# Altium project wifi小车_驱动控制板.PrjPcb
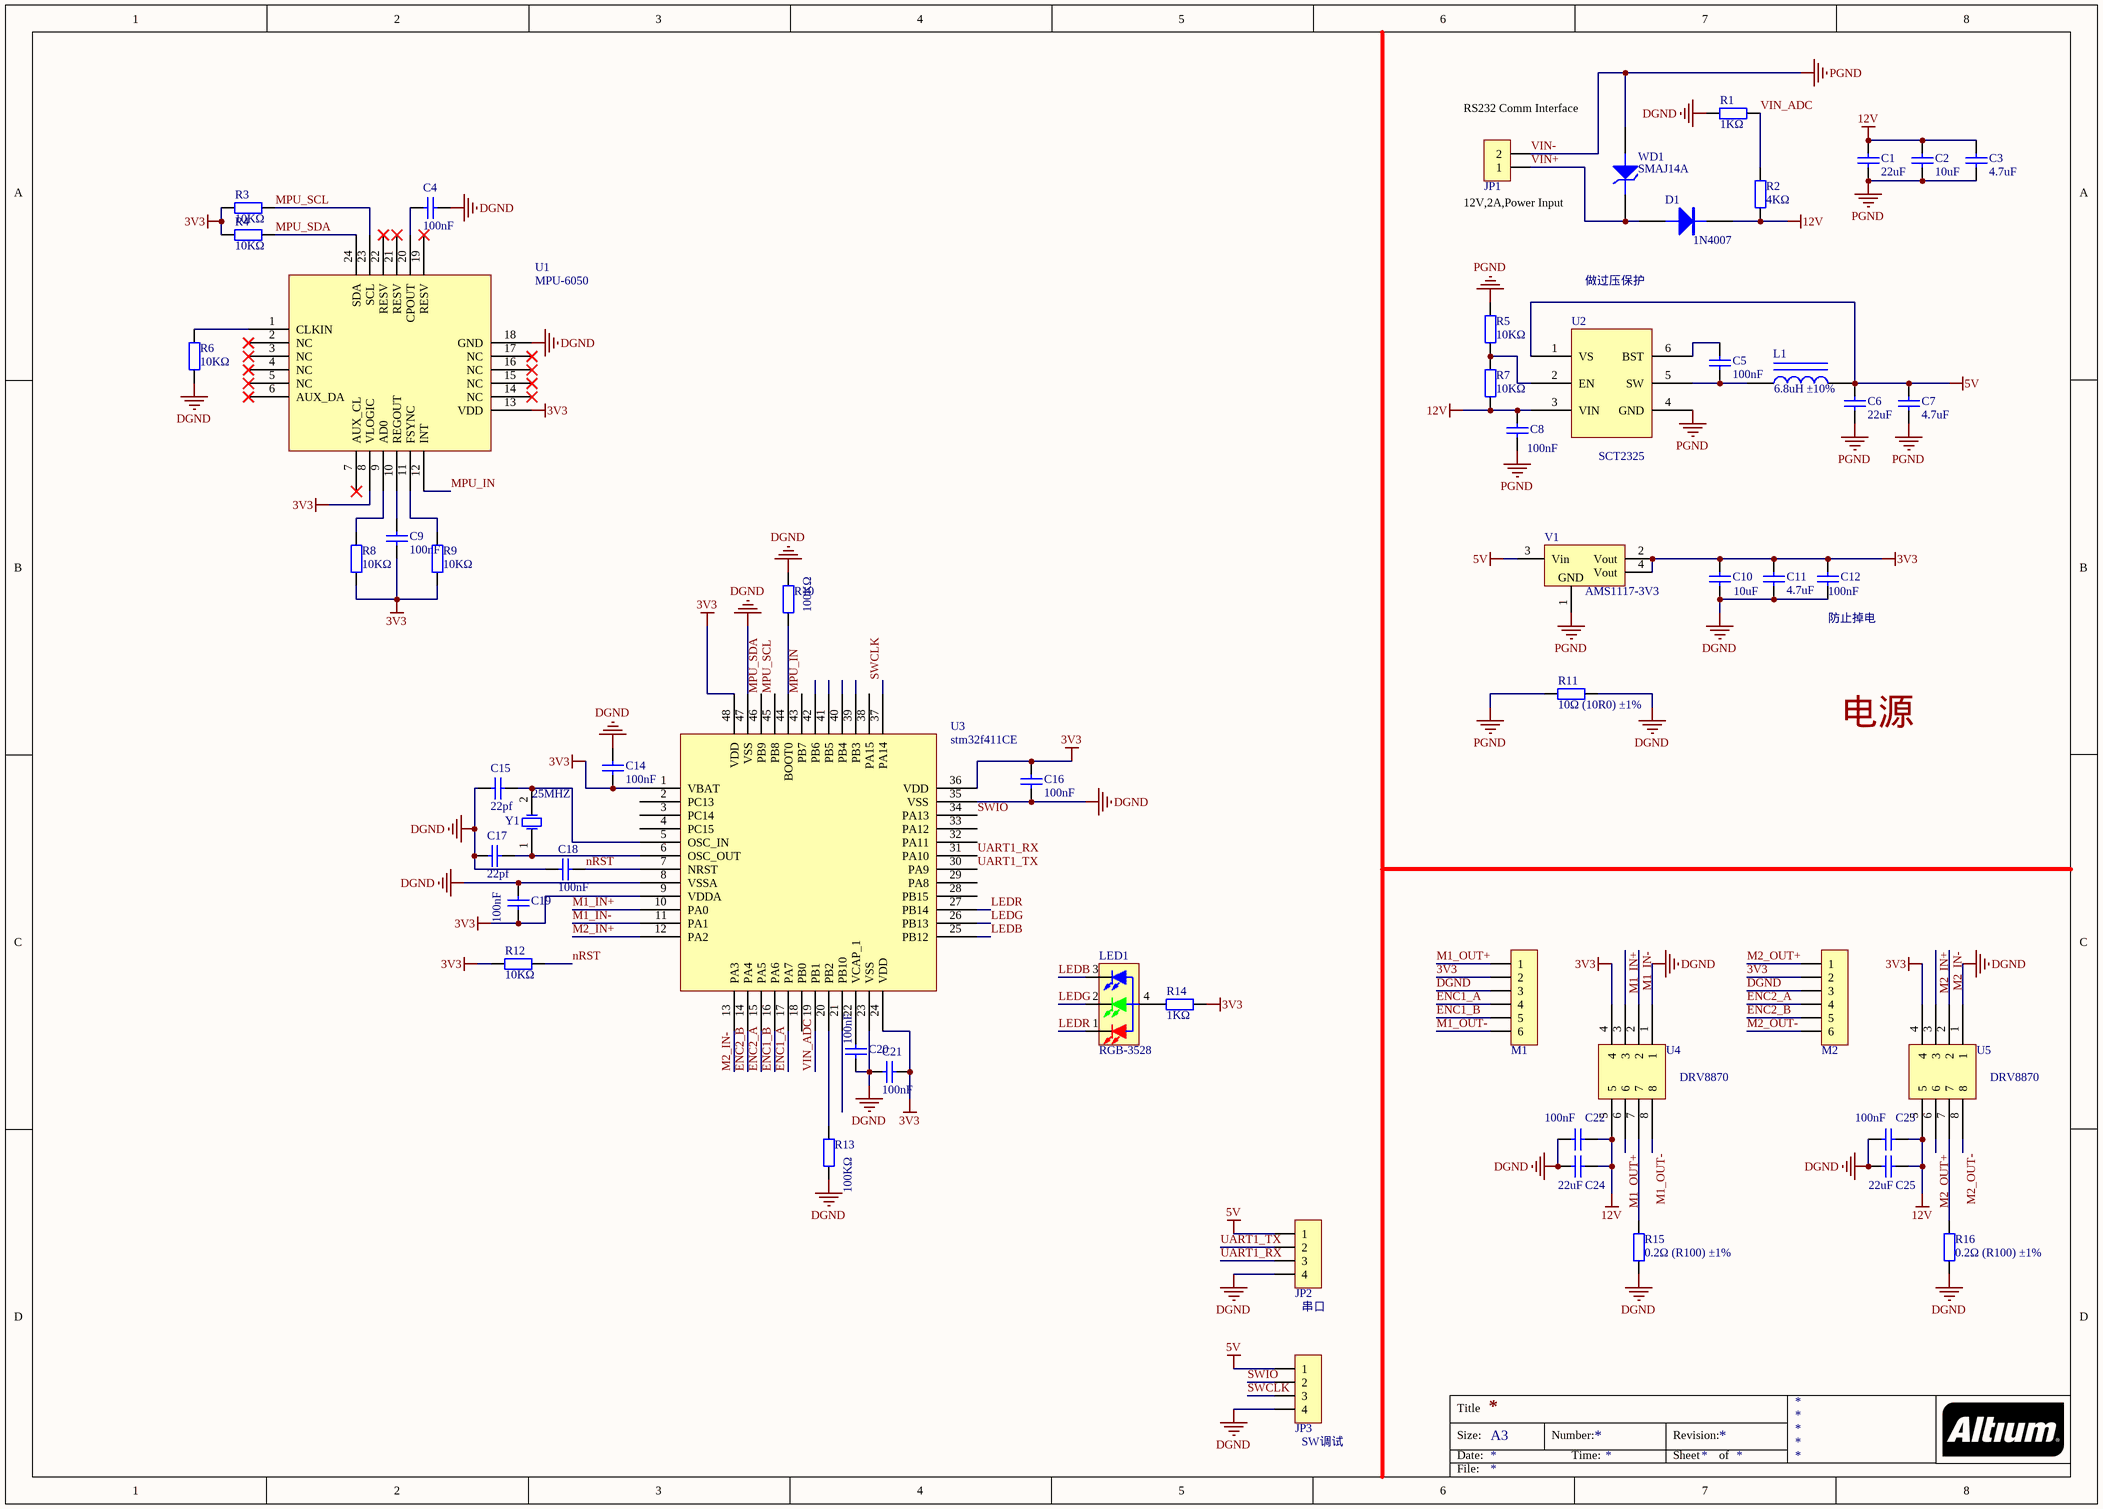
[diagram p0: 驱动控制板原理图.SchDoc]
1 sheet, 56 parts. Net scope: global (net labels, ports and power ports of the same name join across sheets).
Board file: 驱动控制板PCB.PcbDoc

## Sheet 驱动控制板原理图.SchDoc
size A3

### Parts
C1  22uF  [LC-1206_C]
C2  10uF  [LC-0805_C]
C3  4.7uF  [LC-0603_C]
C4  100nF  [LC-0402_C]
C5  100nF  [LC-0402_C]
C6  22uF  [LC-1206_C]
C7  4.7uF  [LC-0603_C]
C8  100nF  [LC-0402_C]
C9  100nF  [LC-0402_C]
C10  10uF  [LC-0805_C]
C11  4.7uF  [LC-0603_C]
C12  100nF  [LC-0402_C]
C14  100nF  [LC-0402_C]
C15  22pf  [LC-0402_C]
C16  100nF  [LC-0402_C]
C17  22pf  [LC-0402_C]
C18  100nF  [LC-0402_C]
C19  100nF  [LC-0402_C]
C20  100nF  [LC-0402_C]
C21  100nF  [LC-0402_C]
C22  100nF  [LC-0805_C]
C23  100nF  [LC-0805_C]
C24  22uF  [LC-1206_C]
C25  22uF  [LC-1206_C]
D1  1N4007  [SMA]
JP1  HDR-1X2  [PH2.0-WI-2P]  (value not drawn)
JP2  串口  [MX 1.25-WI-4P]
JP3  SW调试  [MX 1.25-WI-4P]
L1  6.8uH ±10%  [L-SMD-0630]
LED1  RGB-3528  [LED 3528-4Pin]
M1  HDR-1X6  [ZH1.5-WI-6P]  (value not drawn)
M2  HDR-1X6  [ZH1.5-WI-6P]  (value not drawn)
R1  1KΩ  [LC-0402_R]
R2  4KΩ  [LC-0402_R]
R3  10KΩ  [LC-0402_R]
R4  10KΩ  [LC-0402_R]
R5  10KΩ  [LC-0402_R]
R6  10KΩ  [LC-0402_R]
R7  10KΩ  [LC-0402_R]
R8  10KΩ  [LC-0402_R]
R9  10KΩ  [LC-0402_R]
R10  100KΩ  [LC-0402_R]
R11  10Ω (10R0) ±1%  [LC-1206_R]
R12  10KΩ  [LC-0402_R]
R13  100KΩ  [LC-0402_R]
R14  1KΩ  [LC-0402_R]
R15  0.2Ω (R100) ±1%  [LC-1206_R]
R16  0.2Ω (R100) ±1%  [LC-1206_R]
U1  MPU-6050  [QFN24 4x4_M]
U2  SCT2325  [SOT23-6]
U3  stm32f411CE  [QFN48 7X7_M]
U4  DRV8870  [LC-SOP-8_150mil]
U5  DRV8870  [LC-SOP-8_150mil]
V1  AMS1117-3V3  [SOT223_L]
WD1  SMAJ14A  [SMA]
Y1  25MHZ  [OSC 5032-2P]

### Nets
3V3: C9.2 C10.1 C11.1 C12.2 C14.2 C16.2 C19.1 C21.1 M1.2 M2.2 R3.2 R4.2 R8.1 R9.1 R12.1 R14.2 U1.8(VLOGIC) U1.13(VDD) U3.1(VBAT) U3.9(VDDA) U3.24(VDD) U3.36(VDD) U3.48(VDD) U4.4 U5.4 V1.2(Vout) V1.4(Vout)
5V: C6.2 C7.1 JP2.1 JP3.1 L1.2 U2.1(VS) V1.3(Vin)
12V: C1.1 C2.1 C3.1 C8.2 C22.1 C23.1 C24.1 C25.1 D1.2(K) R2.1 R7.1 U2.3(VIN) U4.5 U5.5
DGND: C4.2 C10.2 C11.2 C12.1 C14.1 C15.1 C16.1 C17.1 C18.1 C19.2 C20.1 C21.2 C22.2 C23.2 C24.2 C25.2 JP2.4 JP3.4 M1.3 M2.3 R1.2 R6.1 R10.2 R11.2 R13.1 R15.2 R16.2 U1.18(GND) U3.8(VSSA) U3.23(VSS) U3.35(VSS) U3.47(VSS) U4.1 U5.1
VIN-: C1.2 C2.2 C3.2 C6.1 C7.2 C8.1 JP1.2 R5.2 R11.1 U2.4(GND) V1.1(GND) WD1.1(A)  [also labelled PGND]
ENC1_A: M1.4 U3.17(PA7)
ENC1_B: M1.5 U3.16(PA6)
ENC2_A: M2.4 U3.15(PA5)
ENC2_B: M2.5 U3.14(PA4)
LEDB: LED1.3(BULE_K) U3.25(PB12)
LEDG: LED1.2(GREEN_K) U3.26(PB13)
LEDR: LED1.1(RED_K) U3.27(PB14)
M1_IN+: U3.10(PA0) U4.3
M1_IN-: U3.11(PA1) U4.2
M1_OUT+: M1.1 U4.6
M1_OUT-: M1.6 U4.8
M2_IN+: U3.12(PA2) U5.3
M2_IN-: U3.13(PA3) U5.2
M2_OUT+: M2.1 U5.6
M2_OUT-: M2.6 U5.8
MPU_IN: U1.12(INT) U3.43(PB7)
MPU_SCL: R3.1 U1.23(SCL) U3.45(PB8)
MPU_SDA: R4.1 U1.24(SDA) U3.46(PB9)
nRST: C18.2 R12.2 U3.7(NRST)
SWCLK: JP3.3 U3.37(PA14)
SWIO: JP3.2 U3.34(PA13)
UART1_RX: JP2.3 U3.31(PA10)
UART1_TX: JP2.2 U3.30(PA9)
VIN+: D1.1(A) JP1.1 WD1.2(K)
VIN_ADC: R1.1 R2.2 U3.19(PB1)
NetC4_1: C4.1 U1.20(CPOUT)
NetC5_1: C5.1 L1.1 U2.5(SW)
NetC5_2: C5.2 U2.6(BST)
NetC9_1: C9.1 U1.10(REGOUT)
NetC15_2: C15.2 U3.5(OSC_IN) Y1.2(OSC2)
NetC17_2: C17.2 U3.6(OSC_OUT) Y1.1(OSC1)
NetC20_2: C20.2 U3.22(VCAP_1)
NetLED1_4: LED1.4(A) R14.1
NetR5_1: R5.1 R7.2 U2.2(EN)
NetR6_2: R6.2 U1.1(CLKIN)
NetR8_2: R8.2 U1.9(AD0)
NetR9_2: R9.2 U1.11(FSYNC)
NetR10_1: R10.1 U3.44(BOOT0)
NetR13_2: R13.2 U3.20(PB2)
NetR15_1: R15.1 U4.7
NetR16_1: R16.1 U5.7

Not connected (* = marked no-connect by the designer): U1 2(NC)* 3(NC)* 4(NC)* 5(NC)* 6(AUX_DA)* 7(AUX_CL)* 14(NC)* 15(NC)* 16(NC)* 17(NC)* 19(RESV)* 21(RESV)* 22(RESV)*; U3 2(PC13) 3(PC14) 4(PC15) 18(PB0) 21(PB10) 28(PB15) 29(PA8) 32(PA11) 33(PA12) 38(PA15) 39(PB3) 40(PB4) 41(PB5) 42(PB6)

### Notes on the sheet
- (near JP1) RS232 Comm Interface
- (near JP1) 12V,2A,Power Input
- 做过压保护
- (near C12) 防止掉电
- 电源
- Title
- Size:
- Date:
- A3
- Number:
- Time:
- Revision:
- Sheet
- of
- File:

### Library data of the parts
C1-C3 C7 C10 C11 = Cap Semi: CAP TAN 22uF 20V T-Case B; Published: 8-Jun-2000; LatestRevisionDate: 29-May-2009; LatestRevisionNote: IPC-7351 Footprint Added.; PackageReference: C1206; Publisher: Altium Limited; PackageDescription: Chip Capacitor
C4 C8 C9 = Cap: CAP ceramic  0.1uF  X7R, SMD 0603; Manufacturer: Generic Components; Class: Passive; SubClass: Capacitor; Published: 08/06/2000; Publisher: Altium Hobart Technology Centre; Value: 100nF
C5 C14-C23 = 0603 100nF (104) 10% 50V: 贴片电容; ComponentLink1Description: 供应商链接; ComponentLink1URL: http://www.szlcsc.com/product/details_15331.html; Package: 0603; Supplier: LC; SuppliersPartNumber: C14663
C6 C24 C25 = 0805 22uF (226) 20% 25V: 贴片电容; ComponentLink1Description: 供应商链接; ComponentLink1URL: http://www.szlcsc.com/product/details_46786.html; Package: 0805; Supplier: LC; SuppliersPartNumber: C45783
C12 = 0402 100nF (104) 10% 16V: 贴片电容; ComponentLink1Description: 供应商链接; ComponentLink1URL: http://www.szlcsc.com/product/details_1877.html; Package: 0402; Supplier: LC; SuppliersPartNumber: C1525
D1 = DIODE
JP1 = Header 2: 2P接插件; 封装库来自淘宝卖家 ID：黄晶宝石: 其他店铺购入均为盗版假冒封装库; BOM名称: 2P接插件
JP2 JP3 = Header 4: 4P接插件; 联系卖家，免费技术支持: 唯一出售店铺网址https://shop463601444.taobao.com; BOM名称: 4P接插件
L1 = 1206 10uH 10%: 贴片电感; ComponentLink1Description: 供应商链接; ComponentLink1URL: http://www.szlcsc.com/product/details_1403.html; Package: 1206; Supplier: LC; SuppliersPartNumber: C1051
LED1 = LED-RGB 3528: 3528三基色LED; BOM名称: 三基色LED; 封装库来自淘宝卖家 ID：黄晶宝石: 其他店铺购入均为盗版，不享受售后技术支持服务，请立即申请退款
M1 M2 = Header 6: 6P接插件; 联系卖家，免费查找封装: 唯一出售店铺网址https://shop463601444.taobao.com; BOM名称: 6P接插件
R1-R9 = 0402 10KΩ (1002) 1%: 贴片电阻; ComponentLink1Description: 供应商链接; ComponentLink1URL: http://www.szlcsc.com/product/details_26487.html; Package: 0402; Supplier: LC; SuppliersPartNumber: C25744
R10 R12-R14 = 0603 110KΩ (1103) 1%: 贴片电阻; ComponentLink1Description: 供应商链接; ComponentLink1URL: http://www.szlcsc.com/product/details_26548.html; Package: 0603; Supplier: LC; SuppliersPartNumber: C25805
R11 = 1206 10Ω (10R0) 1%: 贴片电阻; ComponentLink1Description: 供应商链接; ComponentLink1URL: http://www.szlcsc.com/product/details_18591.html; Package: 1206; Supplier: LC; SuppliersPartNumber: C17903
R15 R16 = 1206 0.1Ω (R100) 1%: 贴片电阻; ComponentLink1Description: 供应商链接; ComponentLink1URL: http://www.szlcsc.com/product/details_26077.html; Package: 1206; Supplier: LC; SuppliersPartNumber: C25334
U1 = MPU-6050: 传感器; ComponentLink1Description: 供应商链接; ComponentLink1URL: http://www.szlcsc.com/product/details_24852.html; Package: QFN-24_4x4x05P; Supplier: LC; SuppliersPartNumber: C24112
U3 = stm32f411
U4 U5 = sop-8
V1 = AMS1117: 三端稳压芯片; BOM名称: 稳压芯片; 封装库来自淘宝卖家 ID：黄晶宝石: 其他店铺购入均为盗版，请立即申请退款，本店现金奖励5~20元; 联系卖家 免费查找封装: 唯一出售店铺网址https://shop463601444.taobao.com
WD1 = ZENER3: Zener Diode
Y1 = XTAL: QC6CB20.0000F18B23R，20MHZ; Published: 8-Jun-2000; LatestRevisionDate: 17-Jul-2002; LatestRevisionNote: Re-released for DXP Platform.; PackageReference: R38; Publisher: Altium Limited; PackageDescription: Crystal, Thru-Hole; 2 Leads; Body 3.1 x 8.2 mm (Dia.xH); value: 25MHZ